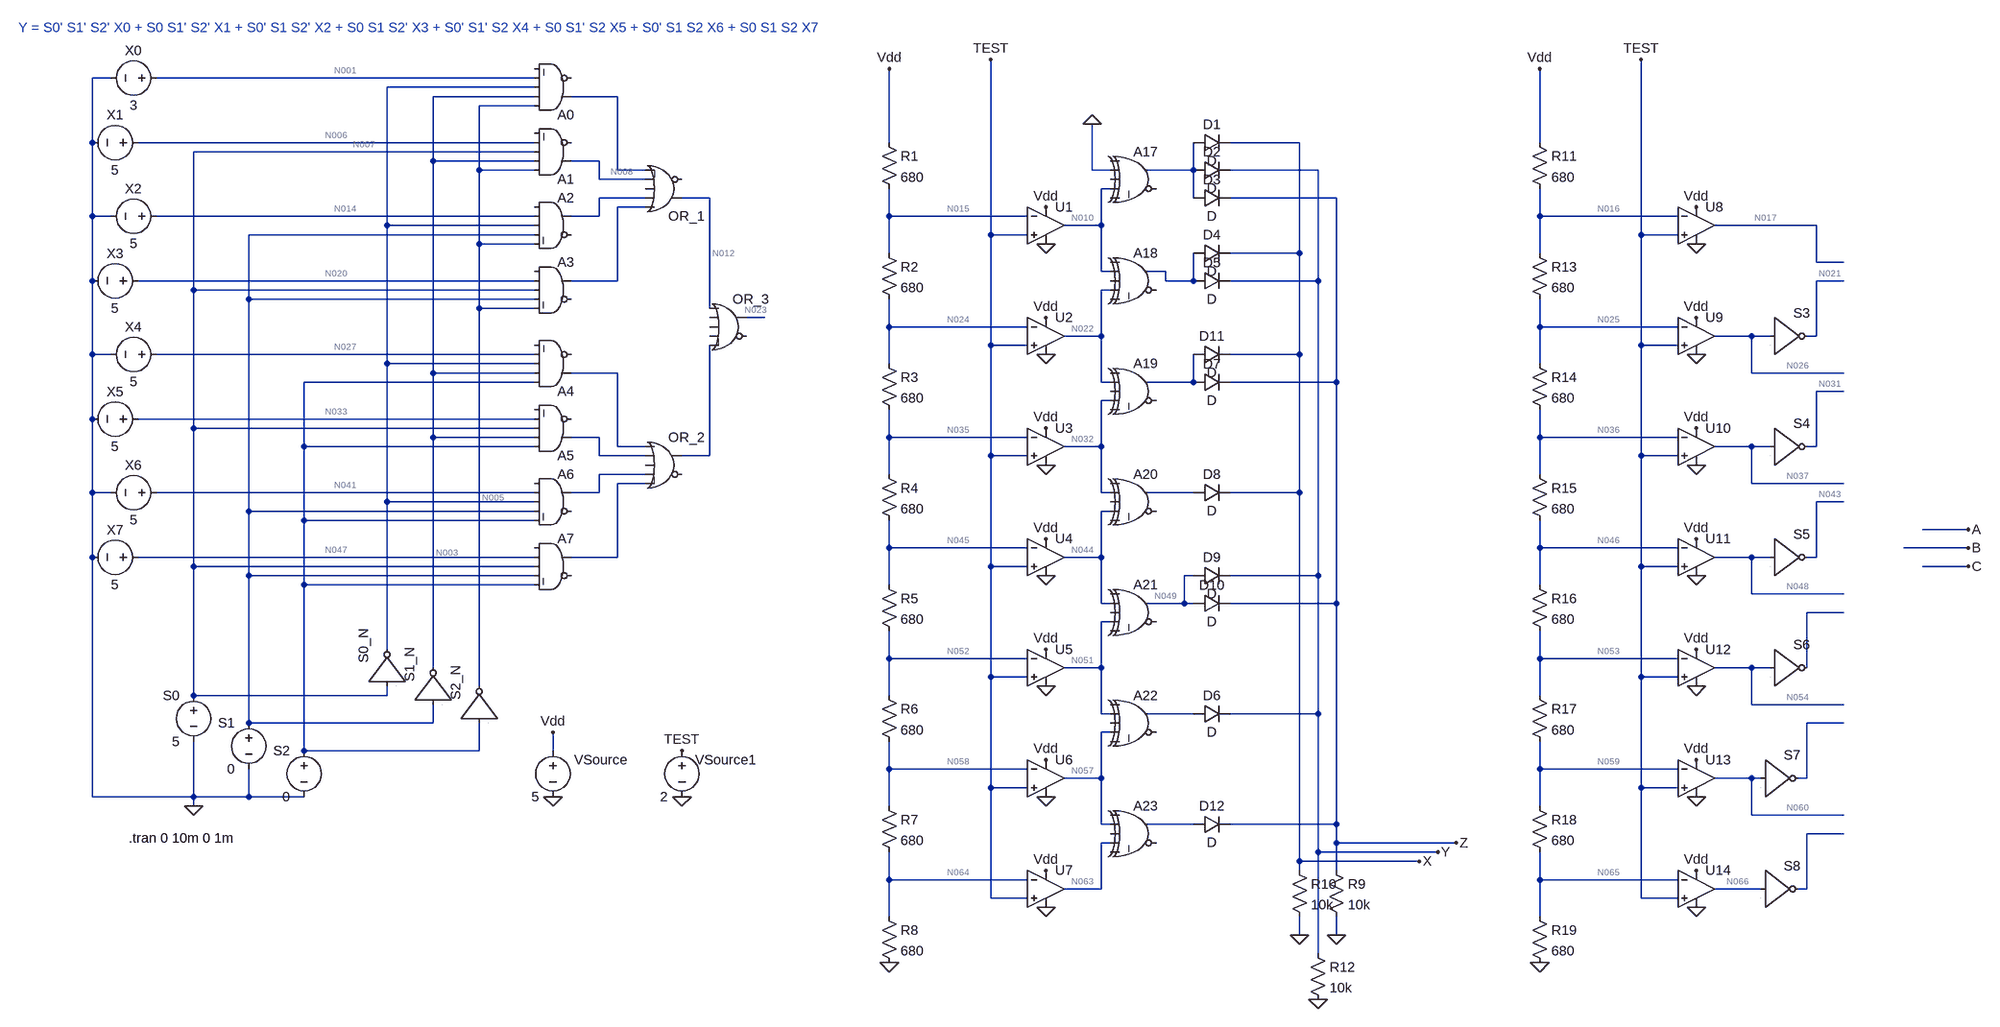
[diagram p0: schematic FLASH.asc]
FLASH.asc, the LTspice schematic file:
Version 4
SHEET 1 3376 1668
WIRE -512 48 -544 48
WIRE 224 48 -432 48
WIRE 224 64 -32 64
WIRE 224 80 48 80
WIRE 368 80 288 80
WIRE 224 96 128 96
WIRE -544 160 -544 48
WIRE 224 160 -464 160
WIRE 880 160 880 32
WIRE 1664 160 1472 160
WIRE 2096 160 2096 32
WIRE 224 176 -368 176
WIRE 48 192 48 80
WIRE 224 192 48 192
WIRE 336 192 288 192
WIRE 128 208 128 96
WIRE 224 208 128 208
WIRE 368 208 368 80
WIRE 416 208 368 208
WIRE 1232 208 1232 128
WIRE 1264 208 1232 208
WIRE 1408 208 1408 160
WIRE 1408 208 1328 208
WIRE 1696 208 1472 208
WIRE 336 224 336 192
WIRE 416 224 336 224
WIRE 1264 240 1248 240
WIRE 416 256 336 256
WIRE 528 256 480 256
WIRE 1408 256 1408 208
WIRE 1728 256 1472 256
WIRE 416 272 368 272
WIRE -544 288 -544 160
WIRE -512 288 -544 288
WIRE 224 288 -432 288
WIRE 336 288 336 256
WIRE 336 288 288 288
WIRE 880 288 880 240
WIRE 1120 288 880 288
WIRE 2096 288 2096 240
WIRE 2336 288 2096 288
WIRE -32 304 -32 64
WIRE 224 304 -32 304
WIRE 1248 304 1248 240
WIRE 1248 304 1184 304
WIRE 2576 304 2400 304
WIRE 224 320 -272 320
WIRE 1056 320 1056 16
WIRE 1120 320 1056 320
WIRE 2272 320 2272 16
WIRE 2336 320 2272 320
WIRE 128 336 128 208
WIRE 224 336 128 336
WIRE 880 352 880 288
WIRE 1664 352 1664 160
WIRE 1664 352 1472 352
WIRE 2096 352 2096 288
WIRE 2576 368 2576 304
WIRE 2624 368 2576 368
WIRE 1248 384 1248 304
WIRE 1264 384 1248 384
WIRE 1360 384 1328 384
WIRE -544 400 -544 288
WIRE 224 400 -464 400
WIRE 368 400 368 272
WIRE 368 400 288 400
WIRE 1360 400 1360 384
WIRE 1408 400 1408 352
WIRE 1408 400 1360 400
WIRE 1696 400 1696 208
WIRE 1696 400 1472 400
WIRE 2624 400 2576 400
WIRE -368 416 -368 176
WIRE 224 416 -368 416
WIRE 1264 416 1248 416
WIRE -272 432 -272 320
WIRE 224 432 -272 432
WIRE 128 448 128 336
WIRE 224 448 128 448
WIRE 528 448 528 256
WIRE 624 464 592 464
WIRE 880 480 880 432
WIRE 1120 480 880 480
WIRE 2096 480 2096 432
WIRE 2336 480 2096 480
WIRE 1248 496 1248 416
WIRE 1248 496 1184 496
WIRE 2464 496 2400 496
WIRE 2496 496 2464 496
WIRE 2576 496 2576 400
WIRE 2576 496 2560 496
WIRE 1056 512 1056 320
WIRE 1120 512 1056 512
WIRE 2272 512 2272 320
WIRE 2336 512 2272 512
WIRE -544 528 -544 400
WIRE -512 528 -544 528
WIRE 224 528 -432 528
WIRE 1664 528 1664 352
WIRE 1664 528 1472 528
WIRE -32 544 -32 304
WIRE 224 544 -32 544
WIRE 880 544 880 480
WIRE 2096 544 2096 480
WIRE 48 560 48 192
WIRE 224 560 48 560
WIRE 368 560 288 560
WIRE 2464 560 2464 496
WIRE 2624 560 2464 560
WIRE 224 576 -176 576
WIRE 1248 576 1248 496
WIRE 1264 576 1248 576
WIRE 1408 576 1408 528
WIRE 1408 576 1328 576
WIRE 1728 576 1728 256
WIRE 1728 576 1472 576
WIRE 2624 592 2576 592
WIRE 1264 608 1248 608
WIRE -544 640 -544 528
WIRE 224 640 -464 640
WIRE -368 656 -368 416
WIRE 224 656 -368 656
WIRE 48 672 48 560
WIRE 224 672 48 672
WIRE 336 672 288 672
WIRE 880 672 880 624
WIRE 1120 672 880 672
WIRE 2096 672 2096 624
WIRE 2336 672 2096 672
WIRE -176 688 -176 576
WIRE 224 688 -176 688
WIRE 368 688 368 560
WIRE 416 688 368 688
WIRE 1248 688 1248 608
WIRE 1248 688 1184 688
WIRE 2464 688 2400 688
WIRE 2496 688 2464 688
WIRE 2576 688 2576 592
WIRE 2576 688 2560 688
WIRE 336 704 336 672
WIRE 416 704 336 704
WIRE 528 704 528 512
WIRE 528 704 480 704
WIRE 1056 704 1056 512
WIRE 1120 704 1056 704
WIRE 2272 704 2272 512
WIRE 2336 704 2272 704
WIRE 416 736 336 736
WIRE 880 736 880 672
WIRE 2096 736 2096 672
WIRE 416 752 368 752
WIRE 2464 752 2464 688
WIRE 2624 752 2464 752
WIRE -544 768 -544 640
WIRE -512 768 -544 768
WIRE 224 768 -432 768
WIRE 336 768 336 736
WIRE 336 768 288 768
WIRE 1248 768 1248 688
WIRE 1264 768 1248 768
WIRE 1408 768 1328 768
WIRE 1664 768 1664 528
WIRE 1664 768 1472 768
WIRE -32 784 -32 544
WIRE 224 784 -32 784
WIRE 2624 784 2576 784
WIRE -272 800 -272 432
WIRE 224 800 -272 800
WIRE 1264 800 1248 800
WIRE -176 816 -176 688
WIRE 224 816 -176 816
WIRE 3232 832 3152 832
WIRE 880 864 880 816
WIRE 1120 864 880 864
WIRE 2096 864 2096 816
WIRE 2336 864 2096 864
WIRE 3232 864 3120 864
WIRE -544 880 -544 768
WIRE 224 880 -464 880
WIRE 368 880 368 752
WIRE 368 880 288 880
WIRE 1248 880 1248 800
WIRE 1248 880 1184 880
WIRE 2464 880 2400 880
WIRE 2496 880 2464 880
WIRE 2576 880 2576 784
WIRE 2576 880 2560 880
WIRE -368 896 -368 656
WIRE 224 896 -368 896
WIRE 1056 896 1056 704
WIRE 1120 896 1056 896
WIRE 2272 896 2272 704
WIRE 2336 896 2272 896
WIRE 3232 896 3152 896
WIRE -272 912 -272 800
WIRE 224 912 -272 912
WIRE 1408 912 1392 912
WIRE 1696 912 1696 400
WIRE 1696 912 1472 912
WIRE -176 928 -176 816
WIRE 224 928 -176 928
WIRE 880 928 880 864
WIRE 2096 928 2096 864
WIRE 2464 944 2464 880
WIRE 2624 944 2464 944
WIRE 1248 960 1248 880
WIRE 1264 960 1248 960
WIRE 1392 960 1392 912
WIRE 1392 960 1328 960
WIRE 1408 960 1392 960
WIRE 1728 960 1728 576
WIRE 1728 960 1472 960
WIRE 2624 976 2560 976
WIRE 1264 992 1248 992
WIRE -32 1040 -32 784
WIRE 880 1056 880 1008
WIRE 1120 1056 880 1056
WIRE 2096 1056 2096 1008
WIRE 2336 1056 2096 1056
WIRE 48 1072 48 672
WIRE 1248 1072 1248 992
WIRE 1248 1072 1184 1072
WIRE 2464 1072 2400 1072
WIRE 2496 1072 2464 1072
WIRE 2560 1072 2560 976
WIRE 1056 1088 1056 896
WIRE 1120 1088 1056 1088
WIRE 2272 1088 2272 896
WIRE 2336 1088 2272 1088
WIRE 128 1104 128 448
WIRE -368 1120 -368 896
WIRE -32 1120 -32 1104
WIRE -32 1120 -368 1120
WIRE 880 1120 880 1056
WIRE 2096 1120 2096 1056
WIRE 2464 1136 2464 1072
WIRE 2624 1136 2464 1136
WIRE 1248 1152 1248 1072
WIRE 1264 1152 1248 1152
WIRE 1408 1152 1328 1152
WIRE 1696 1152 1696 912
WIRE 1696 1152 1472 1152
WIRE -272 1168 -272 912
WIRE 48 1168 48 1136
WIRE 48 1168 -272 1168
WIRE 2624 1168 2560 1168
WIRE 1264 1184 1248 1184
WIRE -176 1216 -176 928
WIRE 128 1216 128 1168
WIRE 128 1216 -176 1216
WIRE 256 1216 256 1184
WIRE 880 1248 880 1200
WIRE 1120 1248 880 1248
WIRE 2096 1248 2096 1200
WIRE 2336 1248 2096 1248
WIRE 1248 1264 1248 1184
WIRE 1248 1264 1184 1264
WIRE 2464 1264 2400 1264
WIRE 2480 1264 2464 1264
WIRE 2560 1264 2560 1168
WIRE 2560 1264 2544 1264
WIRE 1056 1280 1056 1088
WIRE 1120 1280 1056 1280
WIRE 2272 1280 2272 1088
WIRE 2336 1280 2272 1280
WIRE -544 1296 -544 880
WIRE -368 1296 -368 1200
WIRE -368 1296 -544 1296
WIRE -272 1296 -272 1248
WIRE -272 1296 -368 1296
WIRE -176 1296 -272 1296
WIRE -368 1312 -368 1296
WIRE 880 1312 880 1248
WIRE 2096 1312 2096 1248
WIRE 2464 1328 2464 1264
WIRE 2624 1328 2464 1328
WIRE 1248 1344 1248 1264
WIRE 1264 1344 1248 1344
WIRE 1408 1344 1328 1344
WIRE 1728 1344 1728 960
WIRE 1728 1344 1472 1344
WIRE 2624 1360 2560 1360
WIRE 1264 1376 1248 1376
WIRE 1728 1376 1728 1344
WIRE 1936 1376 1728 1376
WIRE 1696 1392 1696 1152
WIRE 1904 1392 1696 1392
WIRE 1664 1408 1664 768
WIRE 1872 1408 1664 1408
WIRE 1664 1424 1664 1408
WIRE 1728 1424 1728 1376
WIRE 880 1440 880 1392
WIRE 1120 1440 880 1440
WIRE 2096 1440 2096 1392
WIRE 2336 1440 2096 1440
WIRE 1248 1456 1248 1376
WIRE 1248 1456 1184 1456
WIRE 2480 1456 2400 1456
WIRE 2560 1456 2560 1360
WIRE 2560 1456 2544 1456
WIRE 1056 1472 1056 1280
WIRE 1120 1472 1056 1472
WIRE 2272 1472 2272 1280
WIRE 2336 1472 2272 1472
WIRE 880 1504 880 1440
WIRE 2096 1504 2096 1440
WIRE 1664 1536 1664 1504
WIRE 1728 1536 1728 1504
WIRE 1696 1568 1696 1392
FLAG -368 1312 0
FLAG 880 32 Vdd
FLAG 1152 464 Vdd
FLAG 1152 272 Vdd
FLAG 1152 656 Vdd
FLAG 1152 848 Vdd
FLAG 1152 1040 Vdd
FLAG 1152 1232 Vdd
FLAG 1152 1424 Vdd
FLAG 1152 1488 0
FLAG 1152 1296 0
FLAG 1152 1104 0
FLAG 1152 912 0
FLAG 1152 720 0
FLAG 1152 528 0
FLAG 1152 336 0
FLAG 880 1584 0
FLAG 3232 832 A
FLAG 3232 864 B
FLAG 3232 896 C
FLAG 256 1184 Vdd
FLAG 256 1296 0
FLAG 480 1216 TEST
FLAG 1056 16 TEST
FLAG 1232 128 0
FLAG 480 1296 0
FLAG 1664 1536 0
FLAG 1728 1536 0
FLAG 1696 1648 0
FLAG 1936 1376 Z
FLAG 1904 1392 Y
FLAG 1872 1408 X
FLAG 2096 32 Vdd
FLAG 2368 464 Vdd
FLAG 2368 272 Vdd
FLAG 2368 656 Vdd
FLAG 2368 848 Vdd
FLAG 2368 1040 Vdd
FLAG 2368 1232 Vdd
FLAG 2368 1424 Vdd
FLAG 2368 1488 0
FLAG 2368 1296 0
FLAG 2368 1104 0
FLAG 2368 912 0
FLAG 2368 720 0
FLAG 2368 528 0
FLAG 2368 336 0
FLAG 2096 1584 0
FLAG 2272 16 TEST
SYMBOL Digital\\and 256 240 M180
SYMATTR InstName A1
SYMATTR SpiceLine vhigh=5
SYMBOL Digital\\and 256 128 M180
SYMATTR InstName A0
SYMATTR SpiceLine vhigh=5
SYMBOL Digital\\and 256 240 R0
SYMATTR InstName A2
SYMATTR SpiceLine vhigh=5
SYMBOL Digital\\and 256 352 R0
SYMATTR InstName A3
SYMATTR SpiceLine vhigh=5
SYMBOL Digital\\and 256 608 M180
SYMATTR InstName A4
SYMATTR SpiceLine vhigh=5
SYMBOL Digital\\and 256 720 M180
SYMATTR InstName A5
SYMATTR SpiceLine vhigh=5
SYMBOL Digital\\and 256 720 R0
SYMATTR InstName A6
SYMATTR SpiceLine vhigh=5
SYMBOL Digital\\and 256 832 R0
SYMATTR InstName A7
SYMATTR SpiceLine vhigh=5
SYMBOL Digital\\or 448 656 R0
SYMATTR InstName OR_2
SYMATTR SpiceLine vhigh=5
SYMBOL Digital\\or 448 304 M180
SYMATTR InstName OR_1
SYMATTR SpiceLine vhigh=5
SYMBOL Digital\\inv -96 1104 R270
SYMATTR InstName S0_N
SYMATTR SpiceLine vhigh=5
SYMBOL Digital\\inv -16 1136 R270
SYMATTR InstName S1_N
SYMATTR SpiceLine vhigh=5
SYMBOL Digital\\inv 64 1168 R270
SYMATTR InstName S2_N
SYMATTR SpiceLine vhigh=5
SYMBOL voltage -368 1104 M0
SYMATTR InstName S0
SYMATTR Value 5
SYMBOL voltage -272 1152 M0
SYMATTR InstName S1
SYMATTR Value 0
SYMBOL voltage -176 1200 M0
SYMATTR InstName S2
SYMATTR Value 0
SYMBOL voltage -416 48 R90
WINDOW 0 -32 56 VBottom 2
WINDOW 3 32 56 VTop 2
SYMATTR InstName X0
SYMATTR Value 3
SYMBOL voltage -448 160 R90
WINDOW 0 -32 56 VBottom 2
WINDOW 3 32 56 VTop 2
SYMATTR InstName X1
SYMATTR Value 5
SYMBOL voltage -416 288 R90
WINDOW 0 -32 56 VBottom 2
WINDOW 3 32 56 VTop 2
SYMATTR InstName X2
SYMATTR Value 5
SYMBOL voltage -448 400 R90
WINDOW 0 -32 56 VBottom 2
WINDOW 3 32 56 VTop 2
SYMATTR InstName X3
SYMATTR Value 5
SYMBOL voltage -416 528 R90
WINDOW 0 -32 56 VBottom 2
WINDOW 3 32 56 VTop 2
SYMATTR InstName X4
SYMATTR Value 5
SYMBOL voltage -448 640 R90
WINDOW 0 -32 56 VBottom 2
WINDOW 3 32 56 VTop 2
SYMATTR InstName X5
SYMATTR Value 5
SYMBOL voltage -416 768 R90
WINDOW 0 -32 56 VBottom 2
WINDOW 3 32 56 VTop 2
SYMATTR InstName X6
SYMATTR Value 5
SYMBOL voltage -448 880 R90
WINDOW 0 -32 56 VBottom 2
WINDOW 3 32 56 VTop 2
SYMATTR InstName X7
SYMATTR Value 5
SYMBOL res 864 144 R0
SYMATTR InstName R1
SYMATTR Value 680
SYMBOL res 864 336 R0
SYMATTR InstName R2
SYMATTR Value 680
SYMBOL res 864 528 R0
SYMATTR InstName R3
SYMATTR Value 680
SYMBOL res 864 720 R0
SYMATTR InstName R4
SYMATTR Value 680
SYMBOL res 864 912 R0
SYMATTR InstName R5
SYMATTR Value 680
SYMBOL res 864 1104 R0
SYMATTR InstName R6
SYMATTR Value 680
SYMBOL res 864 1296 R0
SYMATTR InstName R7
SYMATTR Value 680
SYMBOL res 864 1488 R0
SYMATTR InstName R8
SYMATTR Value 680
SYMBOL OpAmps\\UniversalOpamp2 1152 304 R0
SYMATTR InstName U1
SYMBOL OpAmps\\UniversalOpamp2 1152 496 R0
SYMATTR InstName U2
SYMBOL OpAmps\\UniversalOpamp2 1152 688 R0
SYMATTR InstName U3
SYMBOL OpAmps\\UniversalOpamp2 1152 880 R0
SYMATTR InstName U4
SYMBOL OpAmps\\UniversalOpamp2 1152 1072 R0
SYMATTR InstName U5
SYMBOL OpAmps\\UniversalOpamp2 1152 1264 R0
SYMATTR InstName U6
SYMBOL OpAmps\\UniversalOpamp2 1152 1456 R0
SYMATTR InstName U7
SYMBOL Digital\\inv 2496 432 R0
SYMATTR InstName S3
SYMATTR SpiceLine vhigh=5
SYMBOL Digital\\inv 2496 624 R0
SYMATTR InstName S4
SYMATTR SpiceLine vhigh=5
SYMBOL Digital\\inv 2496 816 R0
SYMATTR InstName S5
SYMATTR SpiceLine vhigh=5
SYMBOL Digital\\inv 2496 1008 R0
SYMATTR InstName S6
SYMATTR SpiceLine vhigh=5
SYMBOL Digital\\inv 2480 1200 R0
SYMATTR InstName S7
SYMATTR SpiceLine vhigh=5
SYMBOL Digital\\inv 2480 1392 R0
SYMATTR InstName S8
SYMATTR SpiceLine vhigh=5
SYMBOL voltage 256 1200 M0
WINDOW 0 -129 32 Left 2
SYMATTR InstName VSource
SYMATTR Value 5
SYMBOL voltage 480 1200 M0
WINDOW 0 -129 32 Left 2
WINDOW 123 0 0 Left 0
WINDOW 39 0 0 Left 0
SYMATTR InstName VSource1
SYMATTR Value 2
SYMBOL Digital\\or 560 416 R0
SYMATTR InstName OR_3
SYMATTR SpiceLine vhigh=5
SYMBOL Digital\\xor 1312 160 R0
SYMATTR InstName A17
SYMATTR SpiceLine vhigh=5
SYMBOL Digital\\xor 1312 336 R0
SYMATTR InstName A18
SYMATTR SpiceLine vhigh=5
SYMBOL Digital\\xor 1312 528 R0
SYMATTR InstName A19
SYMATTR SpiceLine vhigh=5
SYMBOL Digital\\xor 1312 720 R0
SYMATTR InstName A20
SYMATTR SpiceLine vhigh=5
SYMBOL Digital\\xor 1312 912 R0
SYMATTR InstName A21
SYMATTR SpiceLine vhigh=5
SYMBOL Digital\\xor 1312 1104 R0
SYMATTR InstName A22
SYMATTR SpiceLine vhigh=5
SYMBOL Digital\\xor 1312 1296 R0
SYMATTR InstName A23
SYMATTR SpiceLine vhigh=5
SYMBOL diode 1408 224 R270
WINDOW 0 32 32 VTop 2
WINDOW 3 0 32 VBottom 2
SYMATTR InstName D2
SYMBOL diode 1408 176 R270
WINDOW 0 32 32 VTop 2
WINDOW 3 0 32 VBottom 2
SYMATTR InstName D1
SYMBOL diode 1408 272 R270
WINDOW 0 32 32 VTop 2
WINDOW 3 0 32 VBottom 2
SYMATTR InstName D3
SYMBOL diode 1408 368 R270
WINDOW 0 32 32 VTop 2
WINDOW 3 0 32 VBottom 2
SYMATTR InstName D4
SYMBOL diode 1408 416 R270
WINDOW 0 32 32 VTop 2
WINDOW 3 0 32 VBottom 2
SYMATTR InstName D5
SYMBOL diode 1408 592 R270
WINDOW 0 32 32 VTop 2
WINDOW 3 0 32 VBottom 2
SYMATTR InstName D7
SYMBOL diode 1408 784 R270
WINDOW 0 32 32 VTop 2
WINDOW 3 0 32 VBottom 2
SYMATTR InstName D8
SYMBOL diode 1408 976 R270
WINDOW 0 32 32 VTop 2
WINDOW 3 0 32 VBottom 2
SYMATTR InstName D10
SYMBOL diode 1408 928 R270
WINDOW 0 32 32 VTop 2
WINDOW 3 0 32 VBottom 2
SYMATTR InstName D9
SYMBOL diode 1408 544 R270
WINDOW 0 32 32 VTop 2
WINDOW 3 0 32 VBottom 2
SYMATTR InstName D11
SYMBOL diode 1408 1168 R270
WINDOW 0 32 32 VTop 2
WINDOW 3 0 32 VBottom 2
SYMATTR InstName D6
SYMBOL diode 1408 1360 R270
WINDOW 0 32 32 VTop 2
WINDOW 3 0 32 VBottom 2
SYMATTR InstName D12
SYMBOL res 1712 1408 R0
SYMATTR InstName R9
SYMATTR Value 10k
SYMBOL res 1648 1408 R0
SYMATTR InstName R10
SYMATTR Value 10k
SYMBOL res 1680 1552 R0
SYMATTR InstName R12
SYMATTR Value 10k
SYMBOL res 2080 144 R0
SYMATTR InstName R11
SYMATTR Value 680
SYMBOL res 2080 336 R0
SYMATTR InstName R13
SYMATTR Value 680
SYMBOL res 2080 528 R0
SYMATTR InstName R14
SYMATTR Value 680
SYMBOL res 2080 720 R0
SYMATTR InstName R15
SYMATTR Value 680
SYMBOL res 2080 912 R0
SYMATTR InstName R16
SYMATTR Value 680
SYMBOL res 2080 1104 R0
SYMATTR InstName R17
SYMATTR Value 680
SYMBOL res 2080 1296 R0
SYMATTR InstName R18
SYMATTR Value 680
SYMBOL res 2080 1488 R0
SYMATTR InstName R19
SYMATTR Value 680
SYMBOL OpAmps\\UniversalOpamp2 2368 304 R0
SYMATTR InstName U8
SYMBOL OpAmps\\UniversalOpamp2 2368 496 R0
SYMATTR InstName U9
SYMBOL OpAmps\\UniversalOpamp2 2368 688 R0
SYMATTR InstName U10
SYMBOL OpAmps\\UniversalOpamp2 2368 880 R0
SYMATTR InstName U11
SYMBOL OpAmps\\UniversalOpamp2 2368 1072 R0
SYMATTR InstName U12
SYMBOL OpAmps\\UniversalOpamp2 2368 1264 R0
SYMATTR InstName U13
SYMBOL OpAmps\\UniversalOpamp2 2368 1456 R0
SYMATTR InstName U14
TEXT -480 1368 Left 2 !.tran 0 10m 0 1m
TEXT -672 -40 Left 2 ;Y = S0' S1' S2' X0 + S0 S1' S2' X1 + S0' S1 S2' X2 + S0 S1 S2' X3 + S0' S1' S2 X4 + S0 S1' S2 X5 + S0' S1 S2 X6 + S0 S1 S2 X7

The netlist it stands for:
* FLASH.asc
A1 N005 N003 N007 N006 0 0 N008 0 AND vhigh=5
A0 N005 N003 N002 N001 0 0 N004 0 AND vhigh=5
A2 0 N014 N002 N018 N005 0 N011 0 AND vhigh=5
A3 0 N020 N007 N018 N005 0 N013 0 AND vhigh=5
A4 N029 N003 N002 N027 0 0 N028 0 AND vhigh=5
A5 N029 N003 N007 N033 0 0 N034 0 AND vhigh=5
A6 0 N041 N002 N018 N029 0 N039 0 AND vhigh=5
A7 0 N047 N007 N018 N029 0 N040 0 AND vhigh=5
A§OR_2 N028 N034 0 N039 N040 0 N038 0 OR vhigh=5
A§OR_1 N013 N011 0 N008 N004 0 N012 0 OR vhigh=5
A§S0_N N007 0 0 0 0 N002 0 0 BUF vhigh=5
A§S1_N N018 0 0 0 0 N003 0 0 BUF vhigh=5
A§S2_N N029 0 0 0 0 N005 0 0 BUF vhigh=5
V§S0 N007 0 5
V§S1 N018 0 0
V§S2 N029 0 0
V§X0 N001 0 3
V§X1 N006 0 5
V§X2 N014 0 5
V§X3 N020 0 5
V§X4 N027 0 5
V§X5 N033 0 5
V§X6 N041 0 5
V§X7 N047 0 5
R1 Vdd N015 680
R2 N015 N024 680
R3 N024 N035 680
R4 N035 N045 680
R5 N045 N052 680
R6 N052 N058 680
R7 N058 N064 680
R8 N064 0 680
XU1 TEST N015 Vdd 0 N010 level.2 Avol=1Meg GBW=10Meg Slew=10Meg ilimit=25m rail=0 Vos=0 phimargin=45 en=0 enk=0 in=0 ink=0 Rin=500Meg  ; pins IN+ IN- V+ V- OUT
XU2 TEST N024 Vdd 0 N022 level.2 Avol=1Meg GBW=10Meg Slew=10Meg ilimit=25m rail=0 Vos=0 phimargin=45 en=0 enk=0 in=0 ink=0 Rin=500Meg  ; pins IN+ IN- V+ V- OUT
XU3 TEST N035 Vdd 0 N032 level.2 Avol=1Meg GBW=10Meg Slew=10Meg ilimit=25m rail=0 Vos=0 phimargin=45 en=0 enk=0 in=0 ink=0 Rin=500Meg  ; pins IN+ IN- V+ V- OUT
XU4 TEST N045 Vdd 0 N044 level.2 Avol=1Meg GBW=10Meg Slew=10Meg ilimit=25m rail=0 Vos=0 phimargin=45 en=0 enk=0 in=0 ink=0 Rin=500Meg  ; pins IN+ IN- V+ V- OUT
XU5 TEST N052 Vdd 0 N051 level.2 Avol=1Meg GBW=10Meg Slew=10Meg ilimit=25m rail=0 Vos=0 phimargin=45 en=0 enk=0 in=0 ink=0 Rin=500Meg  ; pins IN+ IN- V+ V- OUT
XU6 TEST N058 Vdd 0 N057 level.2 Avol=1Meg GBW=10Meg Slew=10Meg ilimit=25m rail=0 Vos=0 phimargin=45 en=0 enk=0 in=0 ink=0 Rin=500Meg  ; pins IN+ IN- V+ V- OUT
XU7 TEST N064 Vdd 0 N063 level.2 Avol=1Meg GBW=10Meg Slew=10Meg ilimit=25m rail=0 Vos=0 phimargin=45 en=0 enk=0 in=0 ink=0 Rin=500Meg  ; pins IN+ IN- V+ V- OUT
A§S3 N026 0 0 0 0 N021 0 0 BUF vhigh=5
A§S4 N037 0 0 0 0 N031 0 0 BUF vhigh=5
A§S5 N048 0 0 0 0 N043 0 0 BUF vhigh=5
A§S6 N054 0 0 0 0 N050 0 0 BUF vhigh=5
A§S7 N060 0 0 0 0 N056 0 0 BUF vhigh=5
A§S8 N066 0 0 0 0 N062 0 0 BUF vhigh=5
VSource Vdd 0 5
VSource1 TEST 0 2
A§OR_3 N012 0 0 0 N038 0 N023 0 OR vhigh=5
A17 0 0 0 N010 0 0 N009 0 XOR vhigh=5
A18 0 N010 0 N022 0 0 N019 0 XOR vhigh=5
A19 0 N022 0 N032 0 0 N030 0 XOR vhigh=5
A20 0 N032 0 N044 0 0 N042 0 XOR vhigh=5
A21 0 N044 0 N051 0 0 N049 0 XOR vhigh=5
A22 0 N051 0 N057 0 0 N055 0 XOR vhigh=5
A23 0 N057 0 N063 0 0 N061 0 XOR vhigh=5
D2 N009 Y D
D1 N009 X D
D3 N009 Z D
D4 N019 X D
D5 N019 Y D
D7 N030 Z D
D8 N042 X D
D10 N049 Z D
D9 N049 Y D
D11 N030 X D
D6 N055 Y D
D12 N061 Z D
R9 Z 0 10k
R10 X 0 10k
R12 Y 0 10k
R11 Vdd N016 680
R13 N016 N025 680
R14 N025 N036 680
R15 N036 N046 680
R16 N046 N053 680
R17 N053 N059 680
R18 N059 N065 680
R19 N065 0 680
XU8 TEST N016 Vdd 0 N017 level.2 Avol=1Meg GBW=10Meg Slew=10Meg ilimit=25m rail=0 Vos=0 phimargin=45 en=0 enk=0 in=0 ink=0 Rin=500Meg  ; pins IN+ IN- V+ V- OUT
XU9 TEST N025 Vdd 0 N026 level.2 Avol=1Meg GBW=10Meg Slew=10Meg ilimit=25m rail=0 Vos=0 phimargin=45 en=0 enk=0 in=0 ink=0 Rin=500Meg  ; pins IN+ IN- V+ V- OUT
XU10 TEST N036 Vdd 0 N037 level.2 Avol=1Meg GBW=10Meg Slew=10Meg ilimit=25m rail=0 Vos=0 phimargin=45 en=0 enk=0 in=0 ink=0 Rin=500Meg  ; pins IN+ IN- V+ V- OUT
XU11 TEST N046 Vdd 0 N048 level.2 Avol=1Meg GBW=10Meg Slew=10Meg ilimit=25m rail=0 Vos=0 phimargin=45 en=0 enk=0 in=0 ink=0 Rin=500Meg  ; pins IN+ IN- V+ V- OUT
XU12 TEST N053 Vdd 0 N054 level.2 Avol=1Meg GBW=10Meg Slew=10Meg ilimit=25m rail=0 Vos=0 phimargin=45 en=0 enk=0 in=0 ink=0 Rin=500Meg  ; pins IN+ IN- V+ V- OUT
XU13 TEST N059 Vdd 0 N060 level.2 Avol=1Meg GBW=10Meg Slew=10Meg ilimit=25m rail=0 Vos=0 phimargin=45 en=0 enk=0 in=0 ink=0 Rin=500Meg  ; pins IN+ IN- V+ V- OUT
XU14 TEST N065 Vdd 0 N066 level.2 Avol=1Meg GBW=10Meg Slew=10Meg ilimit=25m rail=0 Vos=0 phimargin=45 en=0 enk=0 in=0 ink=0 Rin=500Meg  ; pins IN+ IN- V+ V- OUT
.model D D
.lib standard.dio
.tran 0 10m 0 1m
* Y = S0' S1' S2' X0 + S0 S1' S2' X1 + S0' S1 S2' X2 + S0 S1 S2' X3 + S0' S1' S2 X4 + S0 S1' S2 X5 + S0' S1 S2 X6 + S0 S1 S2 X7
.lib UniversalOpamps2.sub
.backanno
.end

* Results of the author's LTspice run, read from the files saved beside the schematic
* Operating Point, zero values left out:
*   V(n005) = 5 V
*   V(n003) = 5 V
*   V(n007) = 5 V
*   V(n006) = 5 V
*   V(n008) = 5 V
*   V(n001) = 3 V
*   V(n014) = 5 V
*   V(n020) = 5 V
*   V(n027) = 5 V
*   V(n033) = 5 V
*   V(n041) = 5 V
*   V(n047) = 5 V
*   V(n012) = 5 V
*   V(vdd) = 5 V
*   V(n015) = 4.375 V
*   V(n024) = 3.75 V
*   V(n035) = 3.125 V
*   V(n045) = 2.5 V
*   V(n052) = 1.875 V
*   V(n058) = 1.25 V
*   V(n064) = 625 mV
*   V(n010) = 5.962 µV
*   V(test) = 2 V
*   V(n022) = 5.962 µV
*   V(n032) = 5.962 µV
*   V(n044) = 5.966 µV
*   V(n051) = 5 V
*   V(n057) = 5 V
*   V(n063) = 5 V
*   V(n026) = 5.962 µV
*   V(n021) = 5 V
*   V(n037) = 5.962 µV
*   V(n031) = 5 V
*   V(n048) = 5.966 µV
*   V(n043) = 5 V
*   V(n054) = 5 V
*   V(n060) = 5 V
*   V(n066) = 5 V
*   V(n023) = 5 V
*   V(n049) = 4.999 V
*   V(y) = 4.365 V
*   V(z) = 4.365 V
*   V(n016) = 4.375 V
*   V(n025) = 3.75 V
*   V(n036) = 3.125 V
*   V(n046) = 2.5 V
*   V(n053) = 1.875 V
*   V(n059) = 1.25 V
*   V(n065) = 625 mV
*   V(n017) = 5.962 µV
*   I(D12) = -4.375 pA
*   I(D6) = -4.375 pA
*   I(D9) = 436.5 µA
*   I(D10) = 436.5 µA
*   I(D7) = -4.375 pA
*   I(D5) = -4.375 pA
*   I(D3) = -4.375 pA
*   I(D2) = -4.375 pA
*   I(R19) = 919.1 µA
*   I(R18) = 919.1 µA
*   I(R17) = 919.1 µA
*   I(R16) = 919.1 µA
*   I(R15) = 919.1 µA
*   I(R14) = 919.1 µA
*   I(R13) = 919.1 µA
*   I(R11) = 919.1 µA
*   I(R12) = 436.5 µA
*   I(R9) = 436.5 µA
*   I(R8) = 919.1 µA
*   I(R7) = 919.1 µA
*   I(R6) = 919.1 µA
*   I(R5) = 919.1 µA
*   I(R4) = 919.1 µA
*   I(R3) = 919.1 µA
*   I(R2) = 919.1 µA
*   I(R1) = 919.1 µA
*   I(Vsource1) = 14 nA
*   I(Vsource) = -1.846 mA
*   I8(A23) = -4.375 pA
*   I7(A23) = 4.375 pA
*   I8(A22) = -4.375 pA
*   I7(A22) = 4.375 pA
*   I8(A21) = 873.1 µA
*   I7(A21) = -873.1 µA
*   I8(A19) = -4.375 pA
*   I7(A19) = 4.375 pA
*   I8(A18) = -4.375 pA
*   I7(A18) = 4.375 pA
*   I8(A17) = -8.751 pA
*   I7(A17) = 8.751 pA